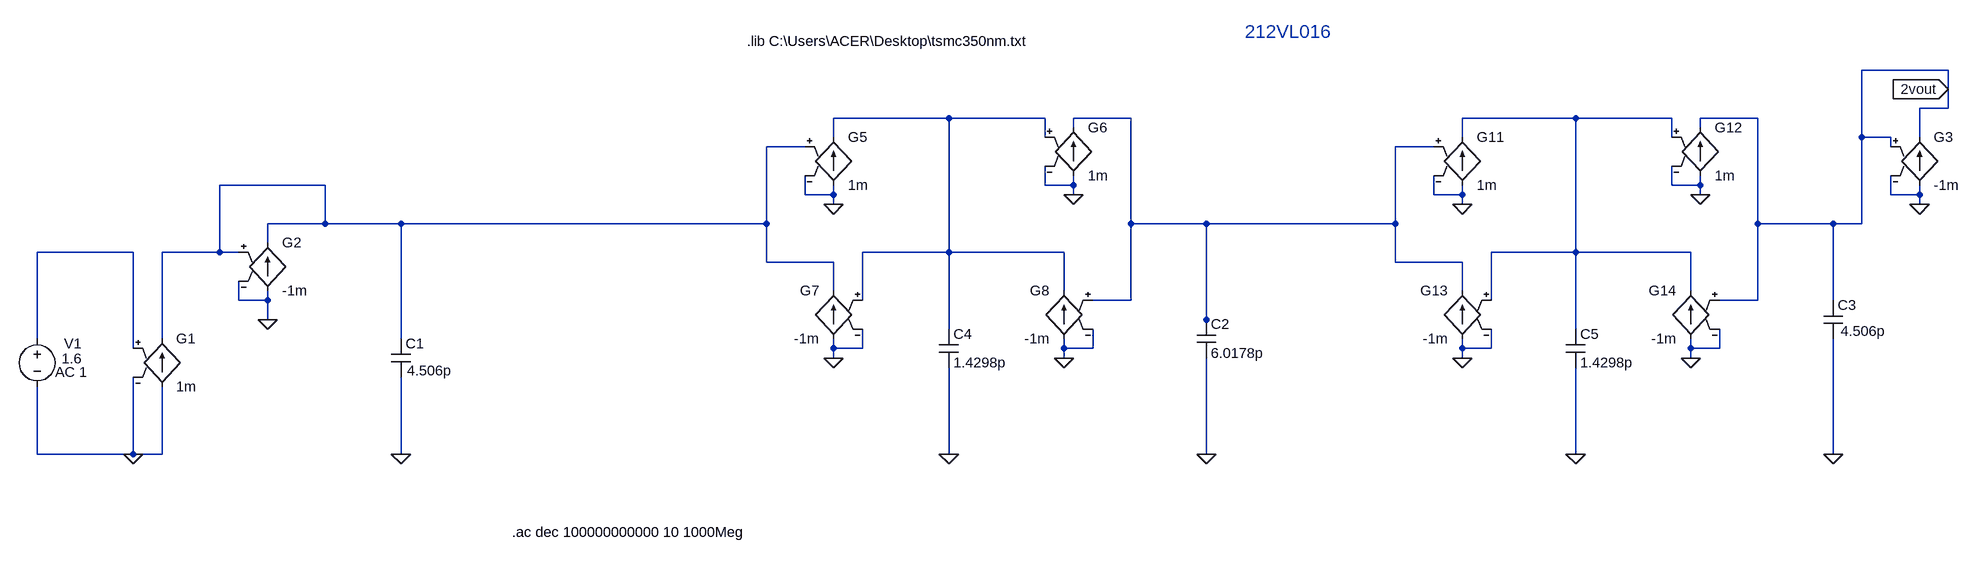
[diagram p0: schematic q2.asc]
q2.asc, the LTspice schematic file:
Version 4
SHEET 1 2092 2796
WIRE 2000 -240 1856 -240
WIRE 2000 -208 2000 -240
WIRE 2000 -176 2000 -208
WIRE 2000 -176 1952 -176
WIRE -128 -160 -320 -160
WIRE 32 -160 -128 -160
WIRE 176 -160 80 -160
WIRE 1312 -160 1120 -160
WIRE 1472 -160 1312 -160
WIRE 1616 -160 1520 -160
WIRE 80 -144 80 -160
WIRE 1520 -144 1520 -160
WIRE -320 -128 -320 -160
WIRE 32 -128 32 -160
WIRE 1120 -128 1120 -160
WIRE 1472 -128 1472 -160
WIRE 1856 -128 1856 -240
WIRE 1904 -128 1856 -128
WIRE 1952 -128 1952 -176
WIRE -368 -112 -432 -112
WIRE 1072 -112 1008 -112
WIRE 1904 -112 1904 -128
WIRE -1216 -48 -1392 -48
WIRE 32 -48 32 -80
WIRE 80 -48 80 -64
WIRE 80 -48 32 -48
WIRE 1472 -48 1472 -80
WIRE 1520 -48 1520 -64
WIRE 1520 -48 1472 -48
WIRE -368 -32 -368 -64
WIRE -320 -32 -320 -48
WIRE -320 -32 -368 -32
WIRE 80 -32 80 -48
WIRE 1072 -32 1072 -64
WIRE 1120 -32 1120 -48
WIRE 1120 -32 1072 -32
WIRE 1520 -32 1520 -48
WIRE 1904 -32 1904 -64
WIRE 1952 -32 1952 -48
WIRE 1952 -32 1904 -32
WIRE -320 -16 -320 -32
WIRE 1120 -16 1120 -32
WIRE 1952 -16 1952 -32
WIRE -1216 16 -1216 -48
WIRE -1216 16 -1312 16
WIRE -1088 16 -1216 16
WIRE -432 16 -432 -112
WIRE -432 16 -1088 16
WIRE 176 16 176 -160
WIRE 368 16 176 16
WIRE 1008 16 1008 -112
WIRE 1008 16 368 16
WIRE 1616 16 1616 -160
WIRE 1808 16 1616 16
WIRE 1856 16 1856 -128
WIRE 1856 16 1808 16
WIRE -1312 48 -1312 16
WIRE -1536 64 -1696 64
WIRE -1392 64 -1392 -48
WIRE -1392 64 -1488 64
WIRE -1360 64 -1392 64
WIRE -128 64 -128 -160
WIRE -128 64 -272 64
WIRE 64 64 -128 64
WIRE 1312 64 1312 -160
WIRE 1312 64 1168 64
WIRE 1504 64 1312 64
WIRE -432 80 -432 16
WIRE -320 80 -432 80
WIRE 1008 80 1008 16
WIRE 1120 80 1008 80
WIRE -320 128 -320 80
WIRE 64 128 64 64
WIRE 1120 128 1120 80
WIRE 1504 128 1504 64
WIRE -1360 144 -1360 112
WIRE -1312 144 -1312 128
WIRE -1312 144 -1360 144
WIRE -272 144 -272 64
WIRE 176 144 176 16
WIRE 176 144 112 144
WIRE 1168 144 1168 64
WIRE 1616 144 1616 16
WIRE 1616 144 1552 144
WIRE 1808 144 1808 16
WIRE -1312 176 -1312 144
WIRE 368 176 368 16
WIRE -128 192 -128 64
WIRE 368 192 368 176
WIRE 1312 192 1312 64
WIRE -1696 208 -1696 64
WIRE -1488 208 -1488 64
WIRE -1088 208 -1088 16
WIRE -1536 224 -1536 64
WIRE -320 224 -320 208
WIRE -272 224 -272 192
WIRE -272 224 -320 224
WIRE 64 224 64 208
WIRE 112 224 112 192
WIRE 112 224 64 224
WIRE 1120 224 1120 208
WIRE 1168 224 1168 192
WIRE 1168 224 1120 224
WIRE 1504 224 1504 208
WIRE 1552 224 1552 192
WIRE 1552 224 1504 224
WIRE -320 240 -320 224
WIRE 64 240 64 224
WIRE 1120 240 1120 224
WIRE 1504 240 1504 224
WIRE -1696 400 -1696 288
WIRE -1536 400 -1536 272
WIRE -1536 400 -1696 400
WIRE -1488 400 -1488 288
WIRE -1488 400 -1536 400
WIRE -1088 400 -1088 272
WIRE -128 400 -128 256
WIRE 368 400 368 240
WIRE 1312 400 1312 256
WIRE 1808 400 1808 208
FLAG -1312 176 0
FLAG -1536 400 0
FLAG -1088 400 0
FLAG -320 240 0
FLAG -320 -16 0
FLAG 80 -32 0
FLAG 64 240 0
FLAG -128 400 0
FLAG 368 400 0
FLAG 1120 240 0
FLAG 1120 -16 0
FLAG 1520 -32 0
FLAG 1504 240 0
FLAG 1312 400 0
FLAG 1808 400 0
FLAG 1952 -16 0
FLAG 2000 -208 2vout
IOPIN 2000 -208 In
SYMBOL cap -1104 208 R0
WINDOW 3 26 53 Left 2
SYMATTR Value 4.506p
SYMATTR InstName C1
SYMBOL cap 352 176 R0
SYMATTR InstName C2
SYMATTR Value 6.0178p
SYMBOL cap 1792 144 R0
WINDOW 3 29 51 Left 2
SYMATTR Value 4.506p
SYMATTR InstName C3
SYMBOL voltage -1696 192 R0
WINDOW 123 30 72 Left 2
WINDOW 39 0 0 Left 0
WINDOW 0 45 24 Left 2
WINDOW 3 41 49 Left 2
SYMATTR Value2 AC 1
SYMATTR InstName V1
SYMATTR Value 1.6
SYMBOL g -1488 192 R0
SYMATTR InstName G1
SYMATTR Value 1m
SYMBOL g -1312 32 R0
SYMATTR InstName G2
SYMATTR Value -1m
SYMBOL g -320 -144 R0
SYMATTR InstName G5
SYMATTR Value 1m
SYMBOL g 80 -160 R0
SYMATTR InstName G6
SYMATTR Value 1m
SYMBOL g -320 112 M0
SYMATTR InstName G7
SYMATTR Value -1m
SYMBOL g 64 112 M0
SYMATTR InstName G8
SYMATTR Value -1m
SYMBOL cap -144 192 R0
SYMATTR InstName C4
SYMATTR Value 1.4298p
SYMBOL g 1120 -144 R0
SYMATTR InstName G11
SYMATTR Value 1m
SYMBOL g 1520 -160 R0
SYMATTR InstName G12
SYMATTR Value 1m
SYMBOL g 1120 112 M0
SYMATTR InstName G13
SYMATTR Value -1m
SYMBOL g 1504 112 M0
SYMATTR InstName G14
SYMATTR Value -1m
SYMBOL cap 1296 192 R0
SYMATTR InstName C5
SYMATTR Value 1.4298p
SYMBOL g 1952 -144 R0
SYMATTR InstName G3
SYMATTR Value -1m
TEXT -856 544 Left 2 !.ac dec 100000000000 10 1000Meg
TEXT 432 -304 Left 3 ;212VL016
TEXT -464 -288 Left 2 !.lib C:\\Users\\ACER\\Desktop\\tsmc350nm.txt

The netlist it stands for:
* q2.asc
C1 N004 0 4.506p
C2 N002 0 6.0178p
C3 2vout 0 4.506p
V1 N005 0 1.6 AC 1
G1 0 N004 N005 0 1m
G2 0 N004 N004 0 -1m
G5 0 N001 N004 0 1m
G6 0 N002 N001 0 1m
G7 0 N004 N001 0 -1m
G8 0 N001 N002 0 -1m
C4 N001 0 1.4298p
G11 0 N003 N002 0 1m
G12 0 2vout N003 0 1m
G13 0 N002 N003 0 -1m
G14 0 N003 2vout 0 -1m
C5 N003 0 1.4298p
G3 0 2vout 2vout 0 -1m
.ac dec 100000000000 10 1000Meg
* 212VL016
.lib C:\Users\ACER\Desktop\tsmc350nm.txt
.backanno
.end